# EAGLE schematic LWOC 2.0 (EAGLE 9.6.2)

## Sheet 1 of 4: POWER + HARDWARE
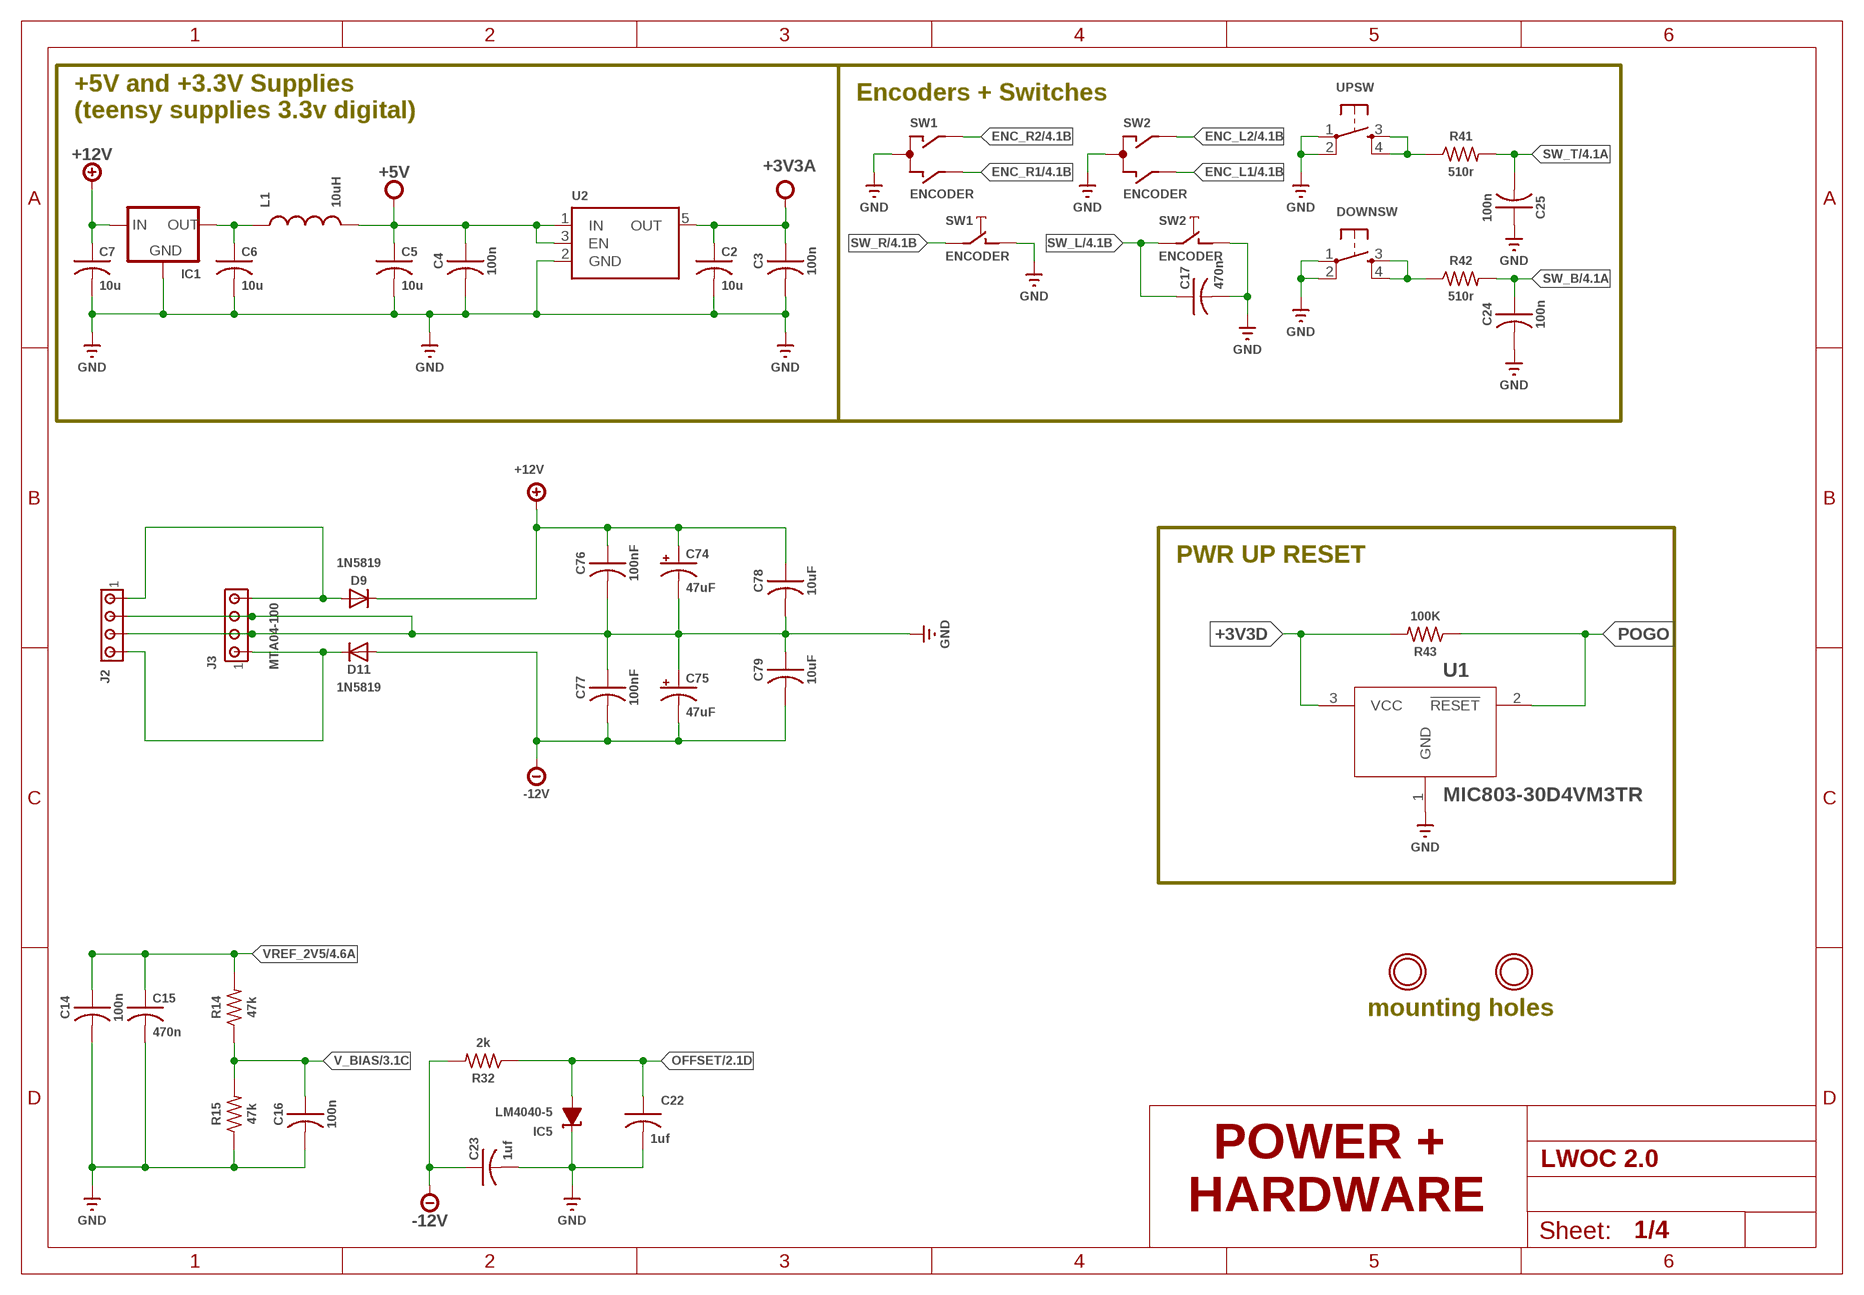
[diagram p0: schematic, sheet 1]

### Parts
C2  10u  C-USC1206K  [C1206K]
C3  100n  RCL_C-USC0603K  [RCL_C0603K]
C4  100n  RCL_C-USC0603K  [RCL_C0603K]
C5  10u  C-USC1206K  [C1206K]
C6  10u  C-USC1206K  [C1206K]
C7  10u  C-USC1206K  [C1206K]
C14  100n  RCL_C-USC0603K  [RCL_C0603K]
C15  470n  RCL_C-USC0603K  [RCL_C0603K]
C16  100n  RCL_C-USC0603K  [RCL_C0603K]
C17  470n  C-USC0805K  [C0805K]
C22  1uf  C-USC0805K  [C0805K]
C23  1uf  C-USC0805K  [C0805K]
C24  100n  RCL_C-USC0603K  [RCL_C0603K]
C25  100n  RCL_C-USC0603K  [RCL_C0603K]
C74  47uF  RCL_CPOL-USE2.5-6  [RCL_E2,5-6]
C75  47uF  RCL_CPOL-USE2.5-6  [RCL_E2,5-6]
C76  100nF  RCL_C-USC0603K  [RCL_C0603K]
C77  100nF  RCL_C-USC0603K  [RCL_C0603K]
C78  10uF  RCL_C-USC1210  [RCL_C1210]
C79  10uF  RCL_C-USC1210  [RCL_C1210]
D9  1N5819  DIODE_DIODE-SOD323-W  [DIODE_SOD323-W]
D11  1N5819  DIODE_DIODE-SOD323-W  [DIODE_SOD323-W]
DOWNSW  SPARKFUN_TAC_SWITCHPTH  [SPARKFUN_TACTILE-PTH]
IC1  LM1117TO252  [TO252]
IC5  LM4040-5  LM4041A12DBZ  [DBZ_R-PDSO-G3]
J2  MTA04-156  [1X4MTA]
J3  MTA04-100  [1X04MTA]
L1  10uH  INDUCTOR1210  [1210]
R14  47k  RCL_R-US_R0603  [RCL_R0603]
R15  47k  RCL_R-US_R0603  [RCL_R0603]
R32  2k  RCL_R-US_R0603  [RCL_R0603]
R41  510r  RCL_R-US_R0603  [RCL_R0603]
R42  510r  RCL_R-US_R0603  [RCL_R0603]
R43  100K  RCL_R-US_R0603  [RCL_R0603]
SW1  ENCODER  OG-ENCODER_EC12E_SW  [OG-ENCODER_ALPS_EC12E_SW]
SW2  ENCODER  OG-ENCODER_EC12E_SW  [OG-ENCODER_ALPS_EC12E_SW]
U1  MIC803-30D4VM3TR  [SOT95P232X110-3N]
U2  ADP121  [SOT23-5]
U$23  MOUNTINGHOLE2.5  [MOUNTINGHOLE_2.5_PLATED]
U$26  MOUNTINGHOLE2.5  [MOUNTINGHOLE_2.5_PLATED]
UPSW  SPARKFUN_TAC_SWITCHPTH  [SPARKFUN_TACTILE-PTH]

### Nets
+3V3A: C2.1 C3.1 U2.5(OUT) ; also sheet 2,4
+3V3D: R43.2 U1.3(VCC) ; also sheet 4
+5V: C4.1 C5.1 L1.2 U2.1(IN) U2.3(EN) ; also sheet 4
+12V: C7.1 C74.+ C76.1 C78.1 D9.C IC1.2(IN) ; also sheet 3
-12V: C23.1 C75.- C77.2 C79.2 D11.A R32.2 ; also sheet 3
ENC_L1: SW2.B ; also sheet 4
ENC_L2: SW2.A ; also sheet 4
ENC_R1: SW1.B ; also sheet 4
ENC_R2: SW1.A ; also sheet 4
GND: C2.2 C3.2 C4.2 C5.2 C6.2 C7.2 C14.2 C15.2 C16.2 C17.2 C22.2 C23.2 C24.2 C25.1 C74.- C75.+ C76.2 C77.1 C78.2 C79.1 DOWNSW.1 DOWNSW.2 IC1.1(GND) IC5.1(C) J2.2 J2.3 J3.2 J3.3 R15.1 SW1.C SW1.D SW2.C SW2.D U1.1(GND) U2.2(GND) UPSW.1 UPSW.2 ; also sheet 2,3,4
N$2: C6.1 IC1.3(OUT) L1.1
N$22: DOWNSW.3 DOWNSW.4 R42.1
N$26: R41.1 UPSW.3 UPSW.4
N$196: D11.C J2.4 J3.4
N$263: D9.A J2.1 J3.1
OFFSET: C22.1 IC5.2(A) R32.1 ; also sheet 2
POGO: R43.1 U1.2(!RESET!)
SW_B: C24.1 R42.2 ; also sheet 4
SW_L: C17.1 SW2.E ; also sheet 4
SW_R: SW1.E ; also sheet 4
SW_T: C25.2 R41.2 ; also sheet 4
V_BIAS: C16.1 R14.1 R15.2 ; also sheet 3
VREF_2V5: C14.1 C15.1 R14.2 ; also sheet 4
Unconnected: SW1.GND1(G) SW1.GND2(G) SW2.GND1(G) SW2.GND2(G)

### Notes on the sheet
- Encoders + Switches
- +5V and +3.3V Supplies
  (teensy supplies 3.3v digital)
- PWR UP RESET
- mounting holes
- POWER + 
  HARDWARE

## Sheet 2 of 4: INPUT STAGES
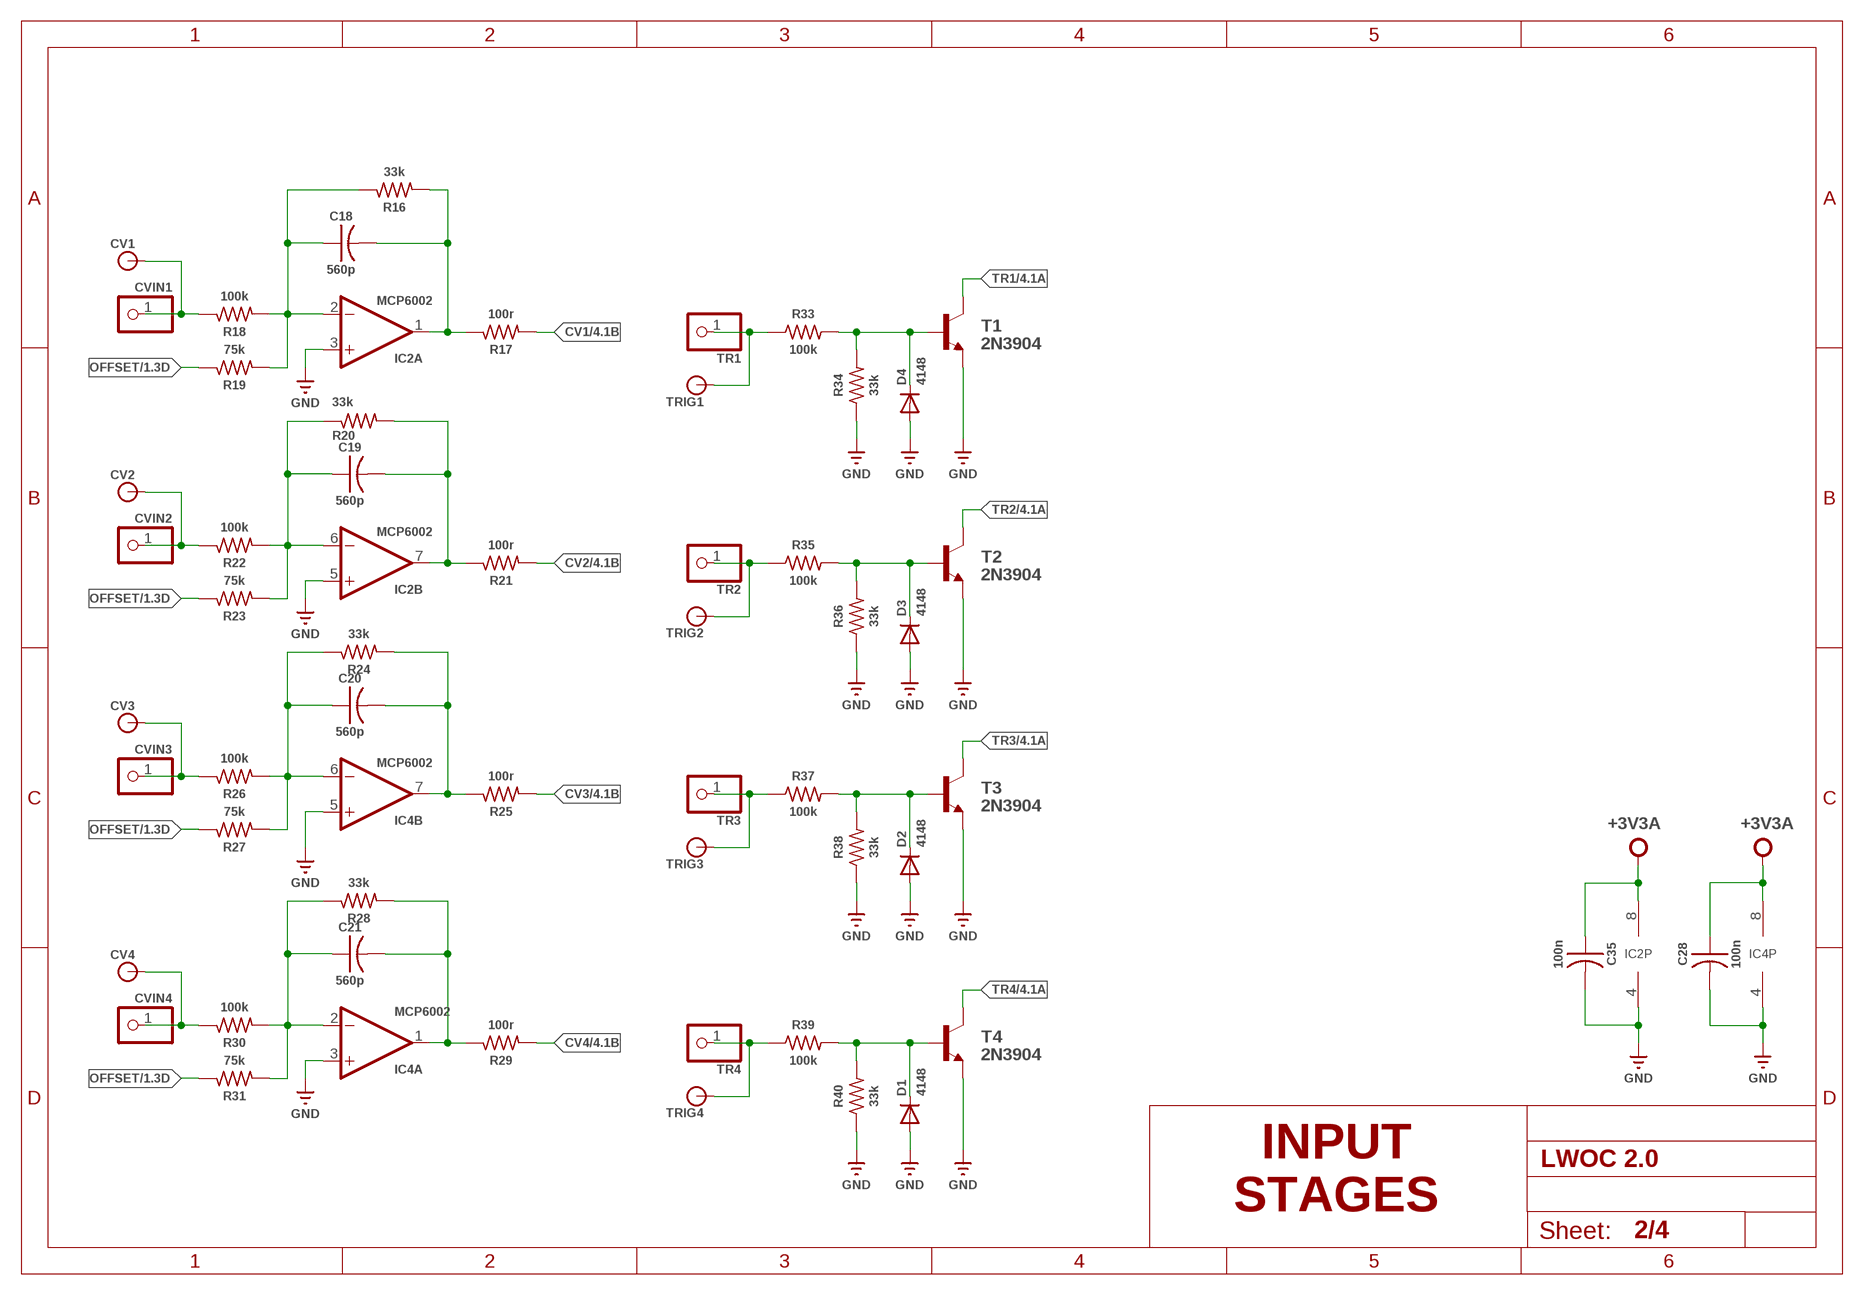
[diagram p1: schematic, sheet 2]

### Parts
C18  560p  RCL_C-USC0603K  [RCL_C0603K]
C19  560p  RCL_C-USC0603K  [RCL_C0603K]
C20  560p  RCL_C-USC0603K  [RCL_C0603K]
C21  560p  RCL_C-USC0603K  [RCL_C0603K]
C28  100n  RCL_C-USC0603K  [RCL_C0603K]
C35  100n  RCL_C-USC0603K  [RCL_C0603K]
CV1  BANANA_CONN  [BANANA_CONN]
CV2  BANANA_CONN  [BANANA_CONN]
CV3  BANANA_CONN  [BANANA_CONN]
CV4  BANANA_CONN  [BANANA_CONN]
CVIN1  PINHD-1X1  [1X01]
CVIN2  PINHD-1X1  [1X01]
CVIN3  PINHD-1X1  [1X01]
CVIN4  PINHD-1X1  [1X01]
D1  4148  DIODE_DIODE-SOD323-W  [DIODE_SOD323-W]
D2  4148  DIODE_DIODE-SOD323-W  [DIODE_SOD323-W]
D3  4148  DIODE_DIODE-SOD323-W  [DIODE_SOD323-W]
D4  4148  DIODE_DIODE-SOD323-W  [DIODE_SOD323-W]
IC2  MCP6002  GM-ICS_TL072D  [GM-ICS_SO08]
IC4  MCP6002  GM-ICS_TL072D  [GM-ICS_SO08]
R16  33k  RCL_R-US_R0603  [RCL_R0603]
R17  100r  RCL_R-US_R0603  [RCL_R0603]
R18  100k  RCL_R-US_R0603  [RCL_R0603]
R19  75k  RCL_R-US_R0603  [RCL_R0603]
R20  33k  RCL_R-US_R0603  [RCL_R0603]
R21  100r  RCL_R-US_R0603  [RCL_R0603]
R22  100k  RCL_R-US_R0603  [RCL_R0603]
R23  75k  RCL_R-US_R0603  [RCL_R0603]
R24  33k  RCL_R-US_R0603  [RCL_R0603]
R25  100r  RCL_R-US_R0603  [RCL_R0603]
R26  100k  RCL_R-US_R0603  [RCL_R0603]
R27  75k  RCL_R-US_R0603  [RCL_R0603]
R28  33k  RCL_R-US_R0603  [RCL_R0603]
R29  100r  RCL_R-US_R0603  [RCL_R0603]
R30  100k  RCL_R-US_R0603  [RCL_R0603]
R31  75k  RCL_R-US_R0603  [RCL_R0603]
R33  100k  RCL_R-US_R0603  [RCL_R0603]
R34  33k  RCL_R-US_R0603  [RCL_R0603]
R35  100k  RCL_R-US_R0603  [RCL_R0603]
R36  33k  RCL_R-US_R0603  [RCL_R0603]
R37  100k  RCL_R-US_R0603  [RCL_R0603]
R38  33k  RCL_R-US_R0603  [RCL_R0603]
R39  100k  RCL_R-US_R0603  [RCL_R0603]
R40  33k  RCL_R-US_R0603  [RCL_R0603]
T1  2N3904  MMBT3904LT1-NPN-SOT23-BEC  [SOT23-BEC]
T2  2N3904  MMBT3904LT1-NPN-SOT23-BEC  [SOT23-BEC]
T3  2N3904  MMBT3904LT1-NPN-SOT23-BEC  [SOT23-BEC]
T4  2N3904  MMBT3904LT1-NPN-SOT23-BEC  [SOT23-BEC]
TR1  PINHD-1X1  [1X01]
TR2  PINHD-1X1  [1X01]
TR3  PINHD-1X1  [1X01]
TR4  PINHD-1X1  [1X01]
TRIG1  BANANA_CONN  [BANANA_CONN]
TRIG2  BANANA_CONN  [BANANA_CONN]
TRIG3  BANANA_CONN  [BANANA_CONN]
TRIG4  BANANA_CONN  [BANANA_CONN]

### Nets
+3V3A: C28.1 C35.1 IC2.8(P:V+) IC4.8(P:V+) ; also sheet 1,4
CV1: R17.2 ; also sheet 4
CV2: R21.2 ; also sheet 4
CV3: R25.2 ; also sheet 4
CV4: R29.2 ; also sheet 4
GND: C28.2 C35.2 D1.A D2.A D3.A D4.A IC2.3(A:+IN) IC2.4(P:V-) IC2.5(B:+IN) IC4.3(A:+IN) IC4.4(P:V-) IC4.5(B:+IN) R34.1 R36.1 R38.1 R40.1 T1.E T2.E T3.E T4.E ; also sheet 1,3,4
N$1: C18.2 IC2.1(A:OUT) R16.2 R17.1
N$4: CV1.P$1 CVIN1.1 R18.1
N$5: R39.1 TR4.1 TRIG4.P$1
N$9: C18.1 IC2.2(A:-IN) R16.1 R18.2 R19.2
N$11: R33.1 TR1.1 TRIG1.P$1
N$15: CV2.P$1 CVIN2.1 R22.1
N$17: C19.1 IC2.6(B:-IN) R20.1 R22.2 R23.2
N$20: C19.2 IC2.7(B:OUT) R20.2 R21.1
N$23: CV3.P$1 CVIN3.1 R26.1
N$24: C20.1 IC4.6(B:-IN) R24.1 R26.2 R27.2
N$25: C20.2 IC4.7(B:OUT) R24.2 R25.1
N$27: CV4.P$1 CVIN4.1 R30.1
N$28: C21.1 IC4.2(A:-IN) R28.1 R30.2 R31.2
N$29: C21.2 IC4.1(A:OUT) R28.2 R29.1
N$31: R35.1 TR2.1 TRIG2.P$1
N$33: D2.C R37.2 R38.2 T3.B
N$34: R37.1 TR3.1 TRIG3.P$1
N$38: D1.C R39.2 R40.2 T4.B
N$40: D3.C R35.2 R36.2 T2.B
N$41: D4.C R33.2 R34.2 T1.B
OFFSET: R19.1 R23.1 R27.1 R31.1 ; also sheet 1
TR1: T1.C ; also sheet 4
TR2: T2.C ; also sheet 4
TR3: T3.C ; also sheet 4
TR4: T4.C ; also sheet 4

### Notes on the sheet
- INPUT
  STAGES

## Sheet 3 of 4: OUTPUT STAGES
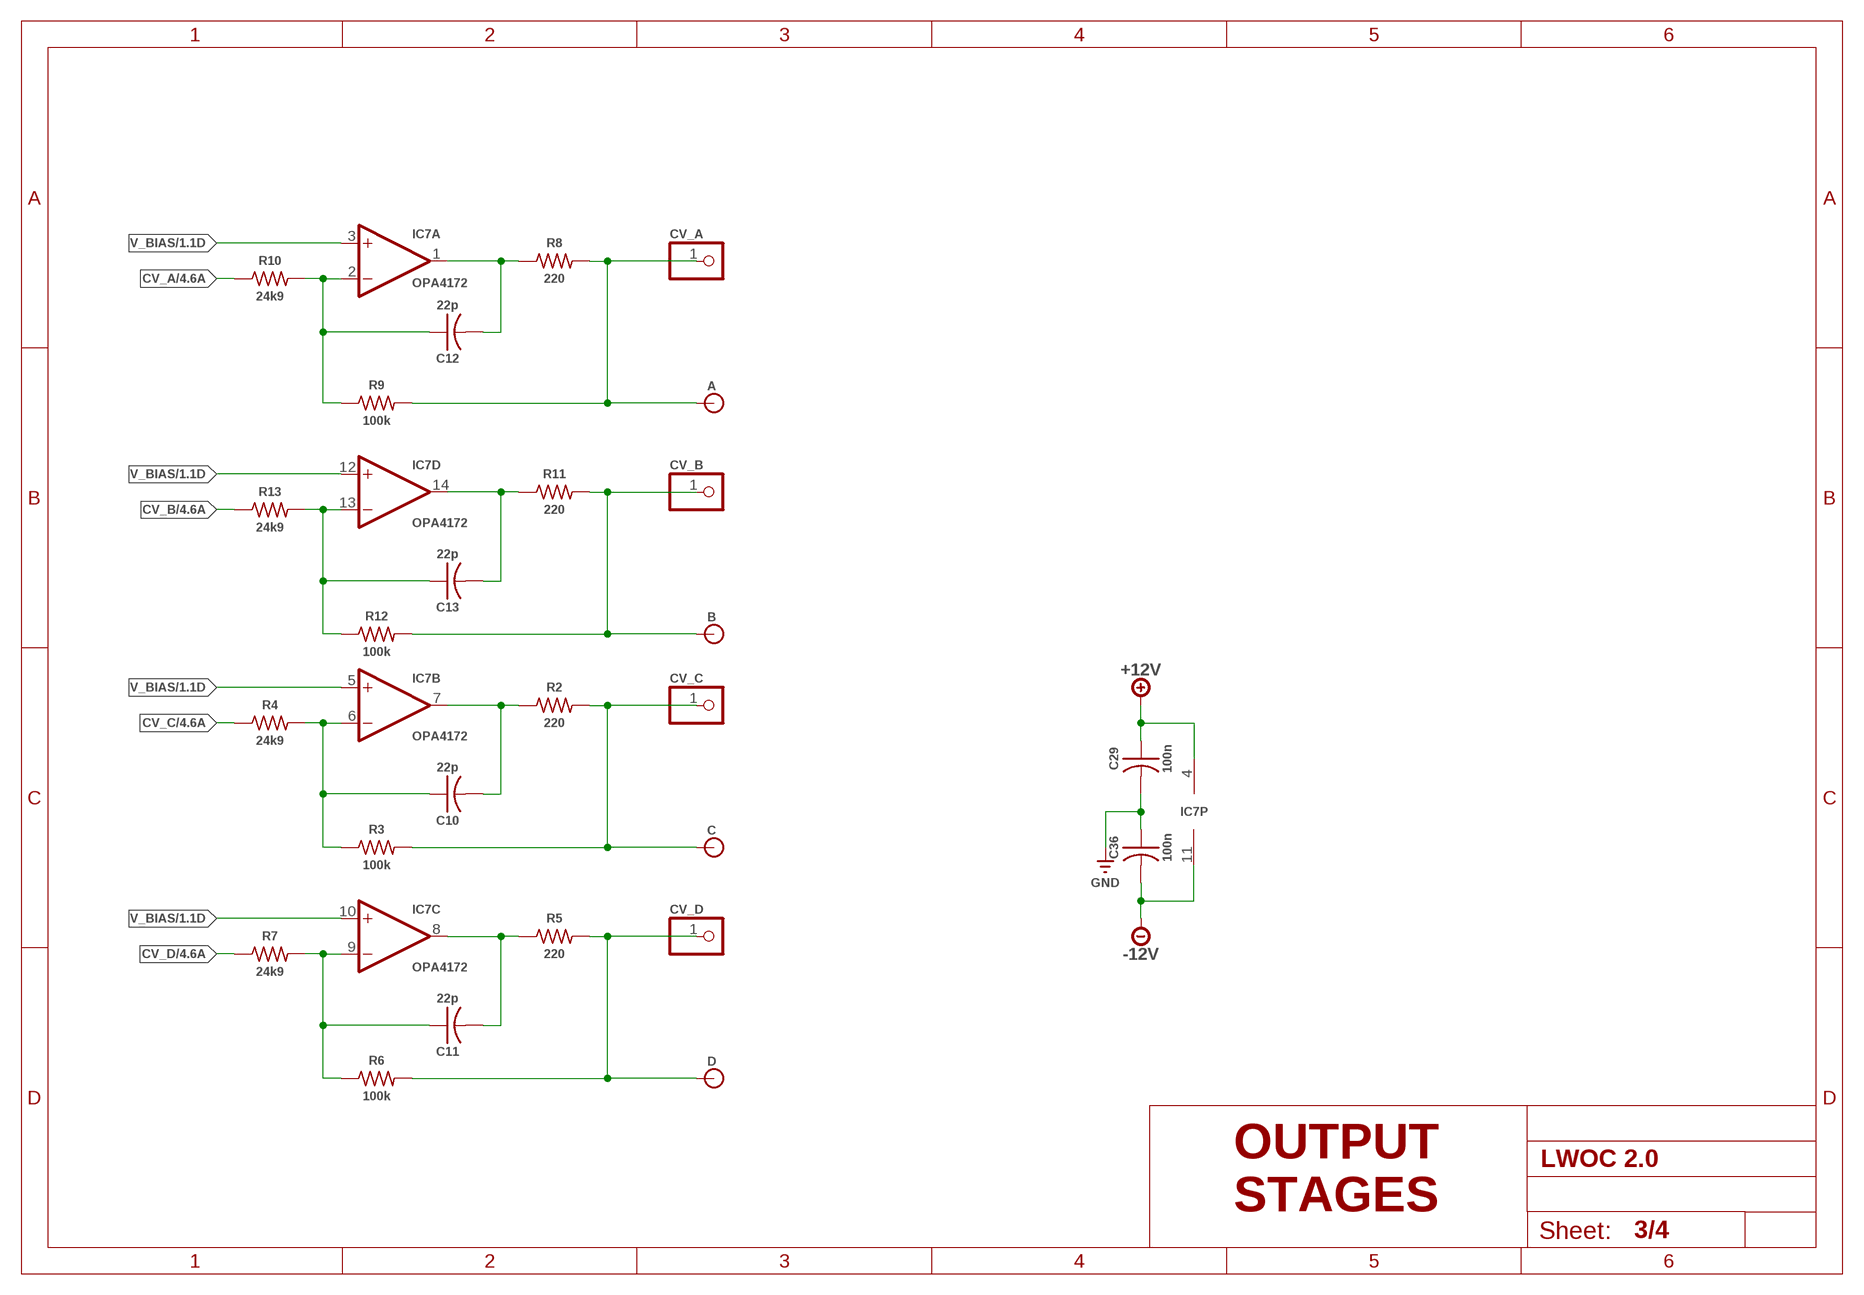
[diagram p2: schematic, sheet 3]

### Parts
A  BANANA_CONN  [BANANA_CONN]
B  BANANA_CONN  [BANANA_CONN]
C  BANANA_CONN  [BANANA_CONN]
C10  22p  RCL_C-USC0603K  [RCL_C0603K]
C11  22p  RCL_C-USC0603K  [RCL_C0603K]
C12  22p  RCL_C-USC0603K  [RCL_C0603K]
C13  22p  RCL_C-USC0603K  [RCL_C0603K]
C29  100n  RCL_C-USC0603K  [RCL_C0603K]
C36  100n  RCL_C-USC0603K  [RCL_C0603K]
CV_A  PINHD-1X1  [1X01]
CV_B  PINHD-1X1  [1X01]
CV_C  PINHD-1X1  [1X01]
CV_D  PINHD-1X1  [1X01]
D  BANANA_CONN  [BANANA_CONN]
IC7  OPA4172  GM-ICS_TL074D  [GM-ICS_SO14]
R2  220  RCL_R-US_R0603  [RCL_R0603]
R3  100k  RCL_R-US_R0603  [RCL_R0603]
R4  24k9  RCL_R-US_R0603  [RCL_R0603]
R5  220  RCL_R-US_R0603  [RCL_R0603]
R6  100k  RCL_R-US_R0603  [RCL_R0603]
R7  24k9  RCL_R-US_R0603  [RCL_R0603]
R8  220  RCL_R-US_R0603  [RCL_R0603]
R9  100k  RCL_R-US_R0603  [RCL_R0603]
R10  24k9  RCL_R-US_R0603  [RCL_R0603]
R11  220  RCL_R-US_R0603  [RCL_R0603]
R12  100k  RCL_R-US_R0603  [RCL_R0603]
R13  24k9  RCL_R-US_R0603  [RCL_R0603]

### Nets
+12V: C29.1 IC7.4(P:V+) ; also sheet 1
-12V: C36.2 IC7.11(P:V-) ; also sheet 1
CV_A: R10.1 ; also sheet 4
CV_B: R13.1 ; also sheet 4
CV_C: R4.1 ; also sheet 4
CV_D: R7.1 ; also sheet 4
GND: C29.2 C36.1 ; also sheet 1,2,4
N$3: C10.1 IC7.6(B:-IN) R3.1 R4.2
N$6: C10.2 IC7.7(B:OUT) R2.1
N$7: C11.1 IC7.9(C:-IN) R6.1 R7.2
N$8: A.P$1 CV_A.1 R8.2 R9.2
N$10: C11.2 IC7.8(C:OUT) R5.1
N$12: C12.1 IC7.2(A:-IN) R9.1 R10.2
N$16: C12.2 IC7.1(A:OUT) R8.1
N$18: C13.1 IC7.13(D:-IN) R12.1 R13.2
N$19: C.P$1 CV_C.1 R2.2 R3.2
N$21: C13.2 IC7.14(D:OUT) R11.1
N$30: B.P$1 CV_B.1 R11.2 R12.2
N$32: CV_D.1 D.P$1 R5.2 R6.2
V_BIAS: IC7.3(A:+IN) IC7.5(B:+IN) IC7.10(C:+IN) IC7.12(D:+IN) ; also sheet 1

### Notes on the sheet
- OUTPUT
  STAGES

## Sheet 4 of 4: TEENSY DAC and OLED
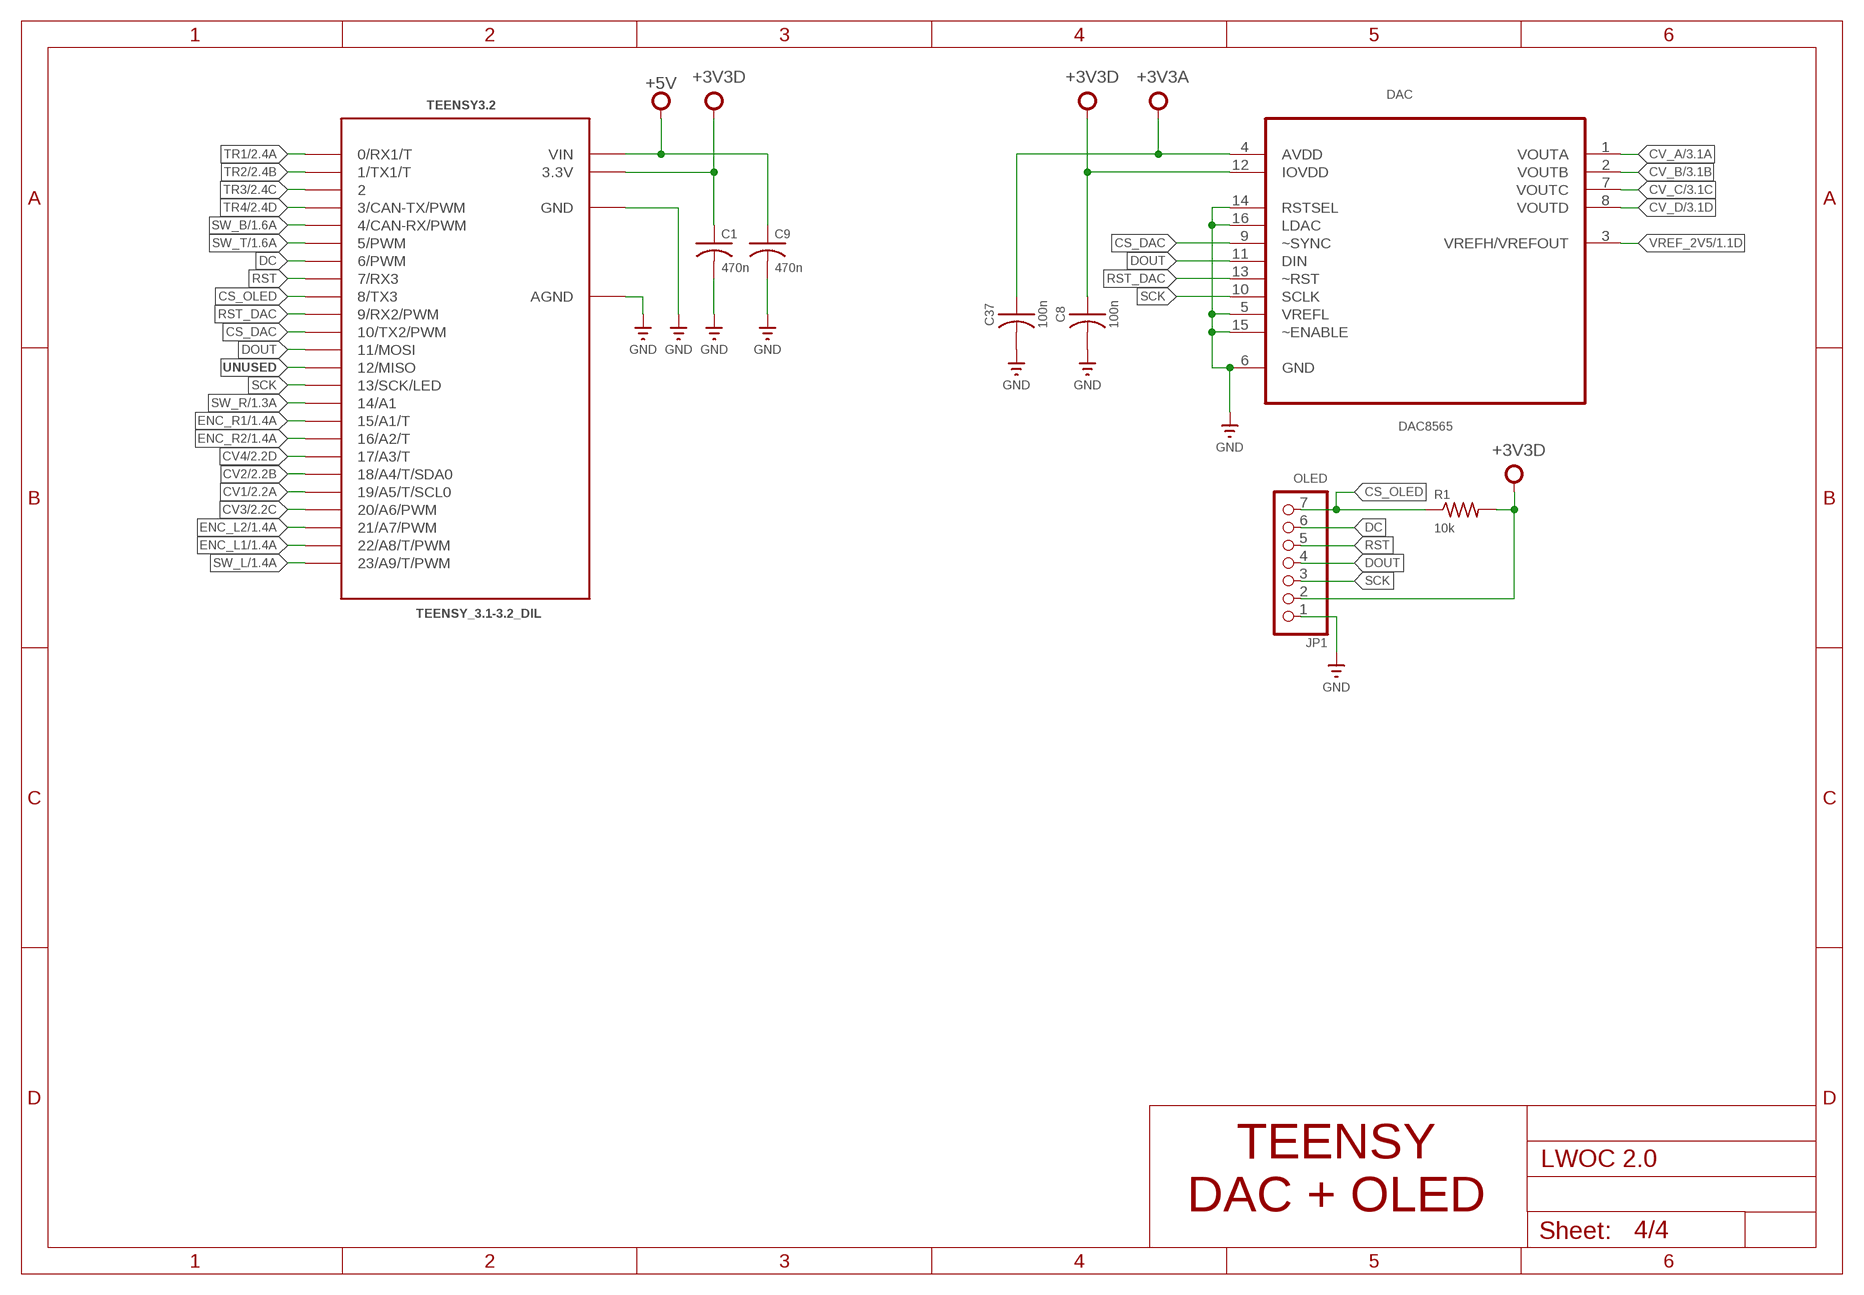
[diagram p3: schematic, sheet 4]

### Parts
C1  470n  C-USC0805K  [C0805K]
C8  100n  RCL_C-USC0603K  [RCL_C0603K]
C9  470n  C-USC0805K  [C0805K]
C37  100n  RCL_C-USC0603K  [RCL_C0603K]
DAC  DAC8565  DAC8565IAPW  [SOP65P640X120-16N]
JP1  OLED  PINHD-1X7  [1X07]
R1  10k  R-US_M0805  [M0805]
TEENSY3.2  TEENSY_3.1-3.2_DIL  [TEENSY_3.0-3.2&LC_DIL]

### Nets
+3V3A: C37.1 DAC.4(AVDD) ; also sheet 1,2
+3V3D: C1.1 C8.1 DAC.12(IOVDD) JP1.2 R1.2 TEENSY3.2.3.3V ; also sheet 1
+5V: C9.1 TEENSY3.2.VIN ; also sheet 1
CS_DAC: DAC.9(~SYNC) TEENSY3.2.10(10/TX2/PWM)
CS_OLED: JP1.7 R1.1 TEENSY3.2.8(8/TX3)
CV1: TEENSY3.2.19/A5(19/A5/T/SCL0) ; also sheet 2
CV2: TEENSY3.2.18/A4(18/A4/T/SDA0) ; also sheet 2
CV3: TEENSY3.2.20/A6(20/A6/PWM) ; also sheet 2
CV4: TEENSY3.2.17/A3(17/A3/T) ; also sheet 2
CV_A: DAC.1(VOUTA) ; also sheet 3
CV_B: DAC.2(VOUTB) ; also sheet 3
CV_C: DAC.7(VOUTC) ; also sheet 3
CV_D: DAC.8(VOUTD) ; also sheet 3
DC: JP1.6 TEENSY3.2.6(6/PWM)
DOUT: DAC.11(DIN) JP1.4 TEENSY3.2.11(11/MOSI)
ENC_L1: TEENSY3.2.22/A8(22/A8/T/PWM) ; also sheet 1
ENC_L2: TEENSY3.2.21/A7(21/A7/PWM) ; also sheet 1
ENC_R1: TEENSY3.2.15/A1(15/A1/T) ; also sheet 1
ENC_R2: TEENSY3.2.16/A2(16/A2/T) ; also sheet 1
GND: C1.2 C8.2 C9.2 C37.2 DAC.5(VREFL) DAC.6(GND) DAC.14(RSTSEL) DAC.15(~ENABLE) DAC.16(LDAC) JP1.1 TEENSY3.2.AGND TEENSY3.2.GND ; also sheet 1,2,3
RST: JP1.5 TEENSY3.2.7(7/RX3)
RST_DAC: DAC.13(~RST) TEENSY3.2.9(9/RX2/PWM)
SCK: DAC.10(SCLK) JP1.3 TEENSY3.2.13(13/SCK/LED)
SW_B: TEENSY3.2.4(4/CAN-RX/PWM) ; also sheet 1
SW_L: TEENSY3.2.23/A9(23/A9/T/PWM) ; also sheet 1
SW_R: TEENSY3.2.14/A0(14/A1) ; also sheet 1
SW_T: TEENSY3.2.5(5/PWM) ; also sheet 1
TR1: TEENSY3.2.0(0/RX1/T) ; also sheet 2
TR2: TEENSY3.2.1(1/TX1/T) ; also sheet 2
TR3: TEENSY3.2.2 ; also sheet 2
TR4: TEENSY3.2.3(3/CAN-TX/PWM) ; also sheet 2
UNUSED: TEENSY3.2.12(12/MISO)
VREF_2V5: DAC.3(VREFH/VREFOUT) ; also sheet 1

### Notes on the sheet
- TEENSY
  DAC + OLED

## Library data of the parts
A B C CV1-CV4 D TRIG1-TRIG4 = SparkFun-Connectors:BANANA_CONN: Through-hole Banana Jack Basic PTH connection for banana jack plugs SparkFun Products: Multimeter Kit <https://www.sparkfun.com/products/retired/10956> Banana to Alligator Cable <https://www.sparkfun.com/products/retired/509> Banana to Alligator Coax Cable <https://www.sparkfun.com/products/retired/508> Banana to Banana Cable <https://www.sparkfun.com/products/retired/507> Banana to IC Hook Cables <https://www.sparkfun.com/products/retired/506>
C1 C2 C5-C7 C9 C17 C22 C23 = elements_v02:C-US: CAPACITOR, American symbol
C3 C4 C8 C10-C16 C18-C21 C24 C25 C28 C29 C35-C37 C78 C79 = clouds_v30:RCL_C-US: CAPACITOR, American symbol
C74 C75 = ripples_v40:RCL_CPOL-US: POLARIZED CAPACITOR, American symbol
C76 C77 = ripples_v40:RCL_C-US: CAPACITOR, American symbol
CV_A CV_B CV_C CV_D CVIN1-CVIN4 TR1-TR4 = pinhead:PINHD-1X1: PIN HEADER
D1-D4 = clouds_v30:DIODE_DIODE-: DIODE
D9 D11 = ripples_v40:DIODE_DIODE-: DIODE
DAC = DAC8565IAPW:DAC8565IAPW: Quad Channel DAC; AVAILABILITY: Good; DESCRIPTION: 16-Bit, Quad Channel, Ultra-Low Glitch, Voltage Output DAC with 2.5V, 2ppm/C Internal eference 16-TSSOP -40 to 105; MF: Texas Instruments; MP: DAC8565IAPW; PACKAGE: TSSOP-16 Texas Instruments; PRICE: 11.99 USD
DOWNSW UPSW = clouds_v30:SPARKFUN_TAC_SWITCH: Momentary Switch Button commonly used for reset or general input. Spark Fun Electronics SKU : COM-00097
IC1 = v-reg-2:LM1117
IC2 IC4 = clouds_v30:GM-ICS_TL072: OP AMP
IC5 = elements_v02:LM4041: PRECISION MICROPOWER SHUNT VOLTAGE REFERENCE Source: http://focus.ti.com/lit/ds/slcs146e/slcs146e.pdf
IC7 = clouds_v30:GM-ICS_TL074: OP AMP
J2 = con-amp:MTA04-156: AMP connector
J3 = AMP_MTA:MTA04-100
JP1 = pinhead:PINHD-1X7: PIN HEADER
L1 = Icotech_Eagle_Library:INDUCTOR: Inductors Basic Inductor/Choke - 0603 and 1206. Footprints are not proven and vary greatly between part numbers.
R1 = elements_v02:R-US_: RESISTOR, American symbol
R2-R43 = clouds_v30:RCL_R-US_: RESISTOR, American symbol
SW1 SW2 = braids_v50:OG-ENCODER_EC12E_SW: ALPS rotary Encoder EC12E series with switch
T1-T4 = transistor:*-NPN-: NPN Transistror BF959 corrected 2008.03.06
TEENSY3.2 = Teensy_3_and_LC_Series_Boards_v1.4:TEENSY_3.1-3.2_DIL: Teensy 3.1 or 3.2 in a DIL Layout.
U1 = Micrel_By_element14_Batch_1:MIC803-30D4VM3TR: 3 Pin Microprocessor Supervisor Circuit; MPN: MIC803-30D4VM3TR; OC_FARNELL: 1924769; OC_NEWARK: 58T4951; PACKAGE: SOT-23-3; SUPPLIER: MICREL SEMICONDUCTOR
U2 = microbuilder:ADP121: LDO Fixed Voltage Regulator 150mA The ADP121 voltage regulator is ideal for regulating battery or solar power due to it's very low foreward voltage drop (maximum 90mV at 150mA). Forward Voltage Dropout: 90mV at 150mA Input Voltage Range: 2.3V-5.5V Output Voltage Range: 1.2V-3.3V (depending on model) Digikey: 3.3V - ADP121-AUJZ33R7CT-ND Digikey: 3.0V - ADP121-AUJZ30R7CT-ND
U$23 U$26 = microbuilder:MOUNTINGHOLE: Mounting Hole For #2 screws (0.086"/2.18mm width, 0.094"/2.4mm hole) use 2.5mm